# EAGLE schematic pwm_driver (EAGLE 5.10)
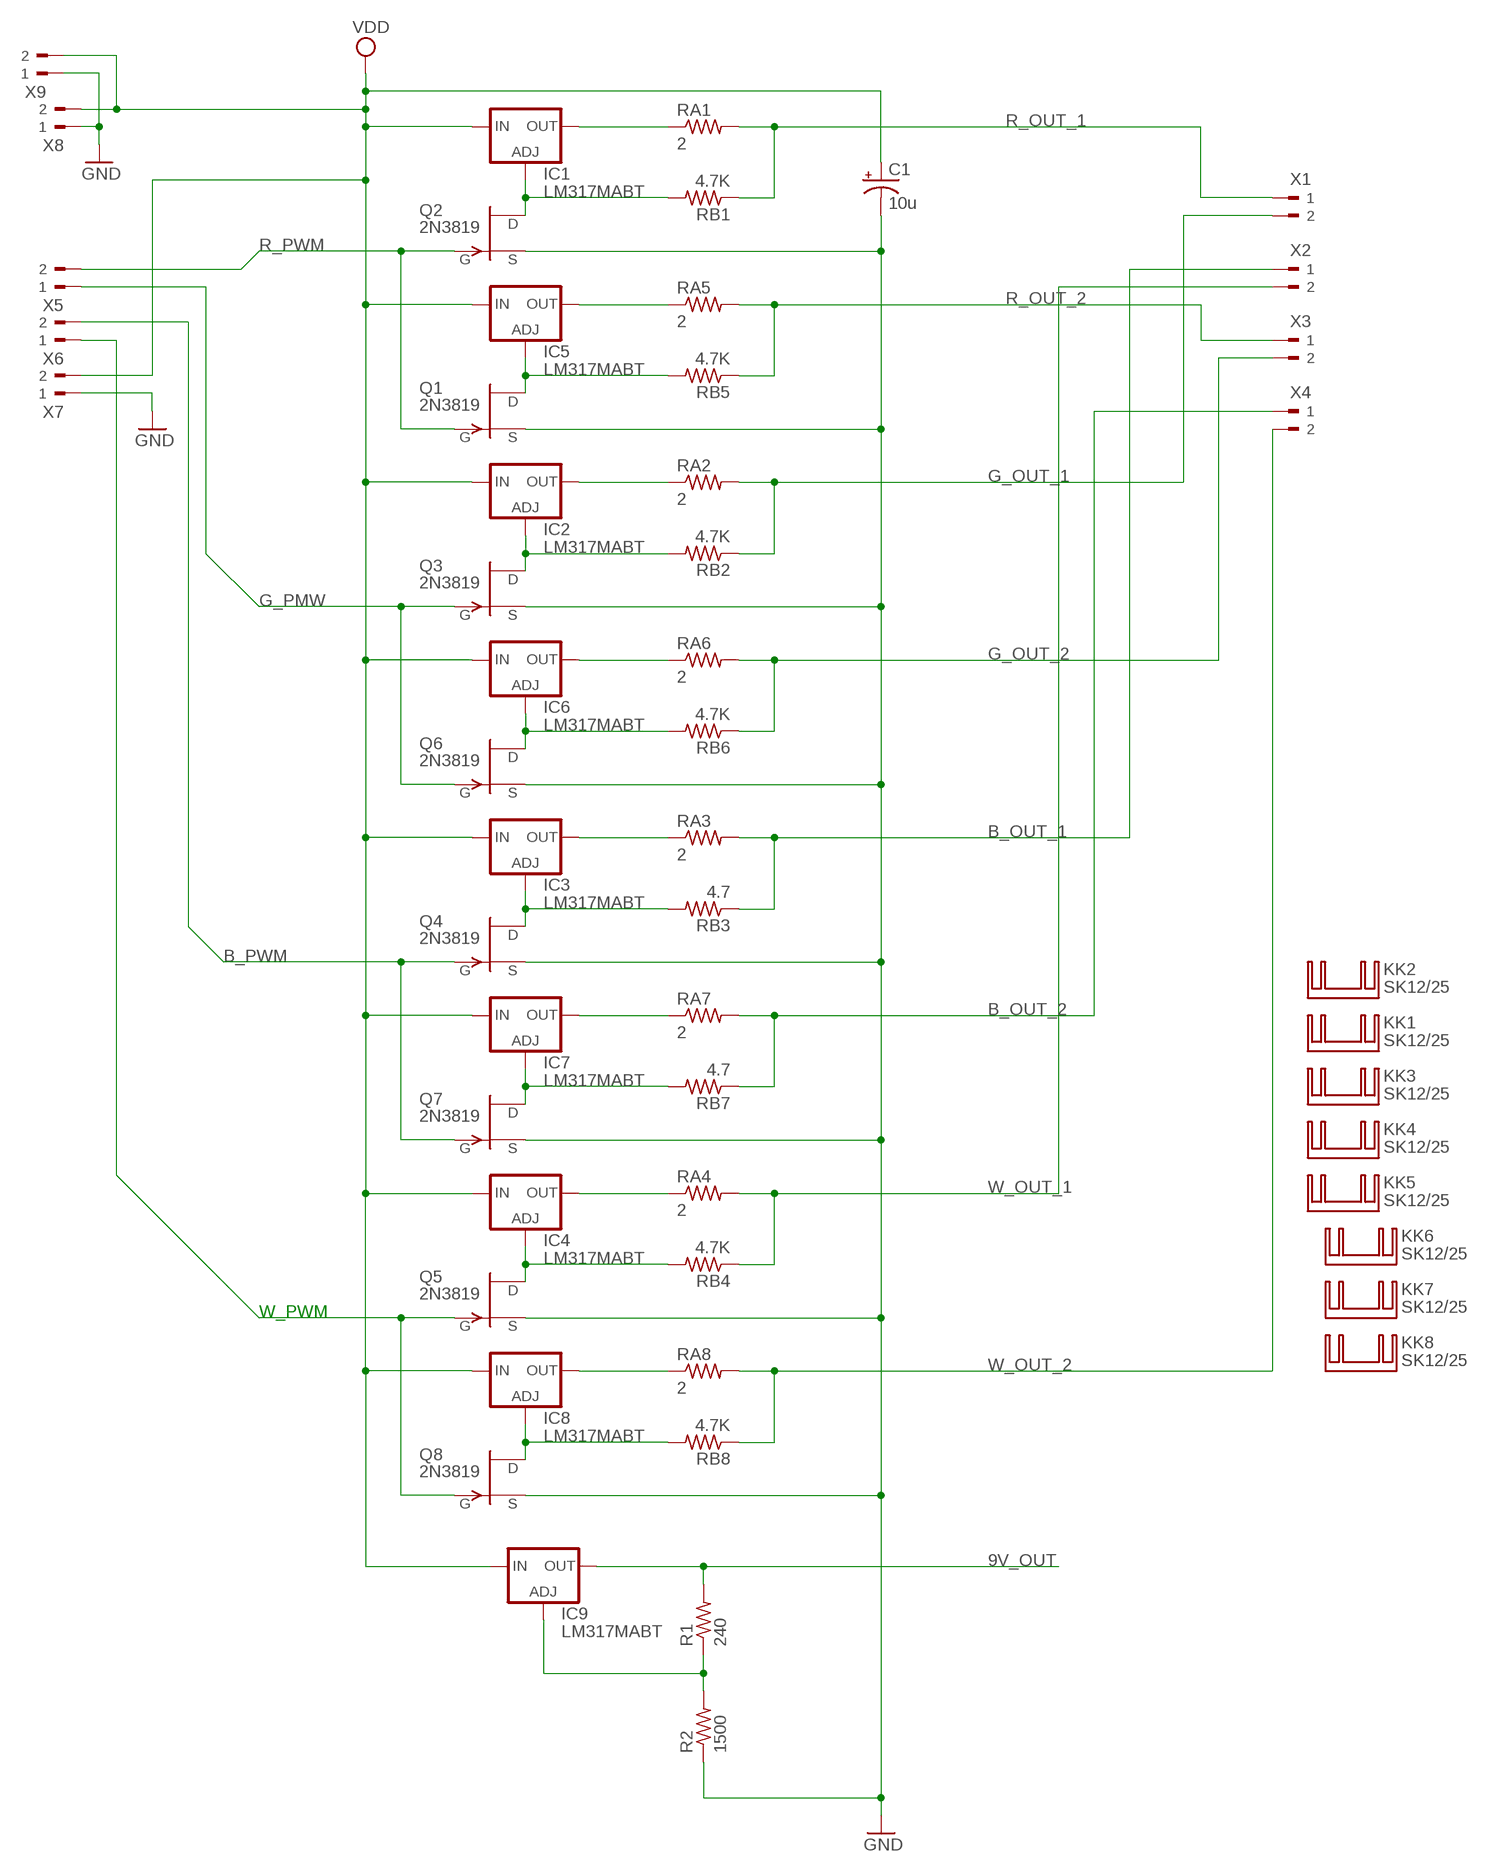
[diagram p0: schematic, sheet 1]

## Parts
C1  10u  CPOL-USE2.5-7  [E2,5-7]
IC1  LM317MABT  [TO220L1]
IC2  LM317MABT  [TO220L1]
IC3  LM317MABT  [TO220L1]
IC4  LM317MABT  [TO220L1]
IC5  LM317MABT  [TO220L1]
IC6  LM317MABT  [TO220L1]
IC7  LM317MABT  [TO220L1]
IC8  LM317MABT  [TO220L1]
IC9  LM317MABT  [TO220L1]
KK1  SK12/25  [SK12/25]
KK2  SK12/25  [SK12/25]
KK3  SK12/25  [SK12/25]
KK4  SK12/25  [SK12/25]
KK5  SK12/25  [SK12/25]
KK6  SK12/25  [SK12/25]
KK7  SK12/25  [SK12/25]
KK8  SK12/25  [SK12/25]
Q1  2N3819  [TO92]
Q2  2N3819  [TO92]
Q3  2N3819  [TO92]
Q4  2N3819  [TO92]
Q5  2N3819  [TO92]
Q6  2N3819  [TO92]
Q7  2N3819  [TO92]
Q8  2N3819  [TO92]
R1  240  R-US_0207/7  [0207/7]
R2  1500  R-US_0207/7  [0207/7]
RA1  2  R-US_0207/15  [0207/15]
RA2  2  R-US_0207/7  [0207/7]
RA3  2  R-US_0207/15  [0207/15]
RA4  2  R-US_0207/15  [0207/15]
RA5  2  R-US_0207/15  [0207/15]
RA6  2  R-US_0207/15  [0207/15]
RA7  2  R-US_0207/15  [0207/15]
RA8  2  R-US_0207/15  [0207/15]
RB1  4.7K  R-US_0207/7  [0207/7]
RB2  4.7K  R-US_0207/7  [0207/7]
RB3  4.7  R-US_0207/7  [0207/7]
RB4  4.7K  R-US_0207/7  [0207/7]
RB5  4.7K  R-US_0207/7  [0207/7]
RB6  4.7K  R-US_0207/7  [0207/7]
RB7  4.7  R-US_0207/7  [0207/7]
RB8  4.7K  R-US_0207/7  [0207/7]
X1  180-2  [180-2]
X2  180-2  [180-2]
X3  180-2  [180-2]
X4  180-2  [180-2]
X5  180-2  [180-2]
X6  180-2  [180-2]
X7  180-2  [180-2]
X8  180-2  [180-2]
X9  180-2  [180-2]

## Nets
9V_OUT: IC9.2(OUT) R1.2
B_OUT_1: RA3.2 RB3.1 X2.1
B_OUT_2: RA7.2 RB7.1 X4.1
B_PWM: Q4.2(G) Q7.2(G) X6.2
G_OUT_1: RA2.2 RB2.1 X1.2
G_OUT_2: RA6.2 RB6.1 X3.2
G_PMW: Q3.2(G) Q6.2(G) X5.1
GND: C1.- Q1.3(S) Q2.3(S) Q3.3(S) Q4.3(S) Q5.3(S) Q6.3(S) Q7.3(S) Q8.3(S) R2.1 X7.1 X8.1 X9.1
N$1: IC1.2(OUT) RA1.1
N$2: IC5.2(OUT) RA5.1
N$3: IC1.1(ADJ) Q2.1(D) RB1.2
N$4: IC2.2(OUT) RA2.1
N$5: IC5.1(ADJ) Q1.1(D) RB5.2
N$6: IC2.1(ADJ) Q3.1(D) RB2.2
N$7: IC3.2(OUT) RA3.1
N$8: IC6.2(OUT) RA6.1
N$9: IC3.1(ADJ) Q4.1(D) RB3.2
N$10: IC4.2(OUT) RA4.1
N$11: IC6.1(ADJ) Q6.1(D) RB6.2
N$12: IC4.1(ADJ) Q5.1(D) RB4.2
N$13: IC7.2(OUT) RA7.1
N$14: IC7.1(ADJ) Q7.1(D) RB7.2
N$15: IC8.2(OUT) RA8.1
N$16: IC8.1(ADJ) Q8.1(D) RB8.2
N$18: IC9.1(ADJ) R1.1 R2.2
R_OUT_1: RA1.2 RB1.1 X1.1
R_OUT_2: RA5.2 RB5.1 X3.1
R_PWM: Q1.2(G) Q2.2(G) X5.2
VDD: C1.+ IC1.3(IN) IC2.3(IN) IC3.3(IN) IC4.3(IN) IC5.3(IN) IC6.3(IN) IC7.3(IN) IC8.3(IN) IC9.3(IN) X7.2 X8.2 X9.2
W_OUT_1: RA4.2 RB4.1 X2.2
W_OUT_2: RA8.2 RB8.1 X4.2
W_PWM: Q5.2(G) Q8.2(G) X6.1

## Library data of the parts
C1 = resistor:CPOL-US: POLARIZED CAPACITOR, American symbol
IC1-IC9 = v-reg:LM317?*: 500 mA Adjustable Output Positive Voltage Regulator Source: http://www.onsemi.co.jp .. LM317M-D.PDF
KK1-KK8 = heatsink:SK12/25: HEATSINK manufacturer Fischer/distributor Buerklin
Q1-Q8 = transistor-fet:2N3819: N-Channel Junction FET
R1 R2 RA1-RA8 RB1-RB8 = resistor:R-US_: RESISTOR, American symbol
X1-X9 = con-weidmueller-sl35:180-2: WEIDMUELLER CLAMP CONNECTOR